# Altium schematic sheet currentU_conditioning.SchDoc
size A4; SheetNumber: 2; SheetTotal: 12; SPICEModelCacheJNOYGZHY: <root> / <DocumentId>JNOYGZHY</DocumentId> / </root>
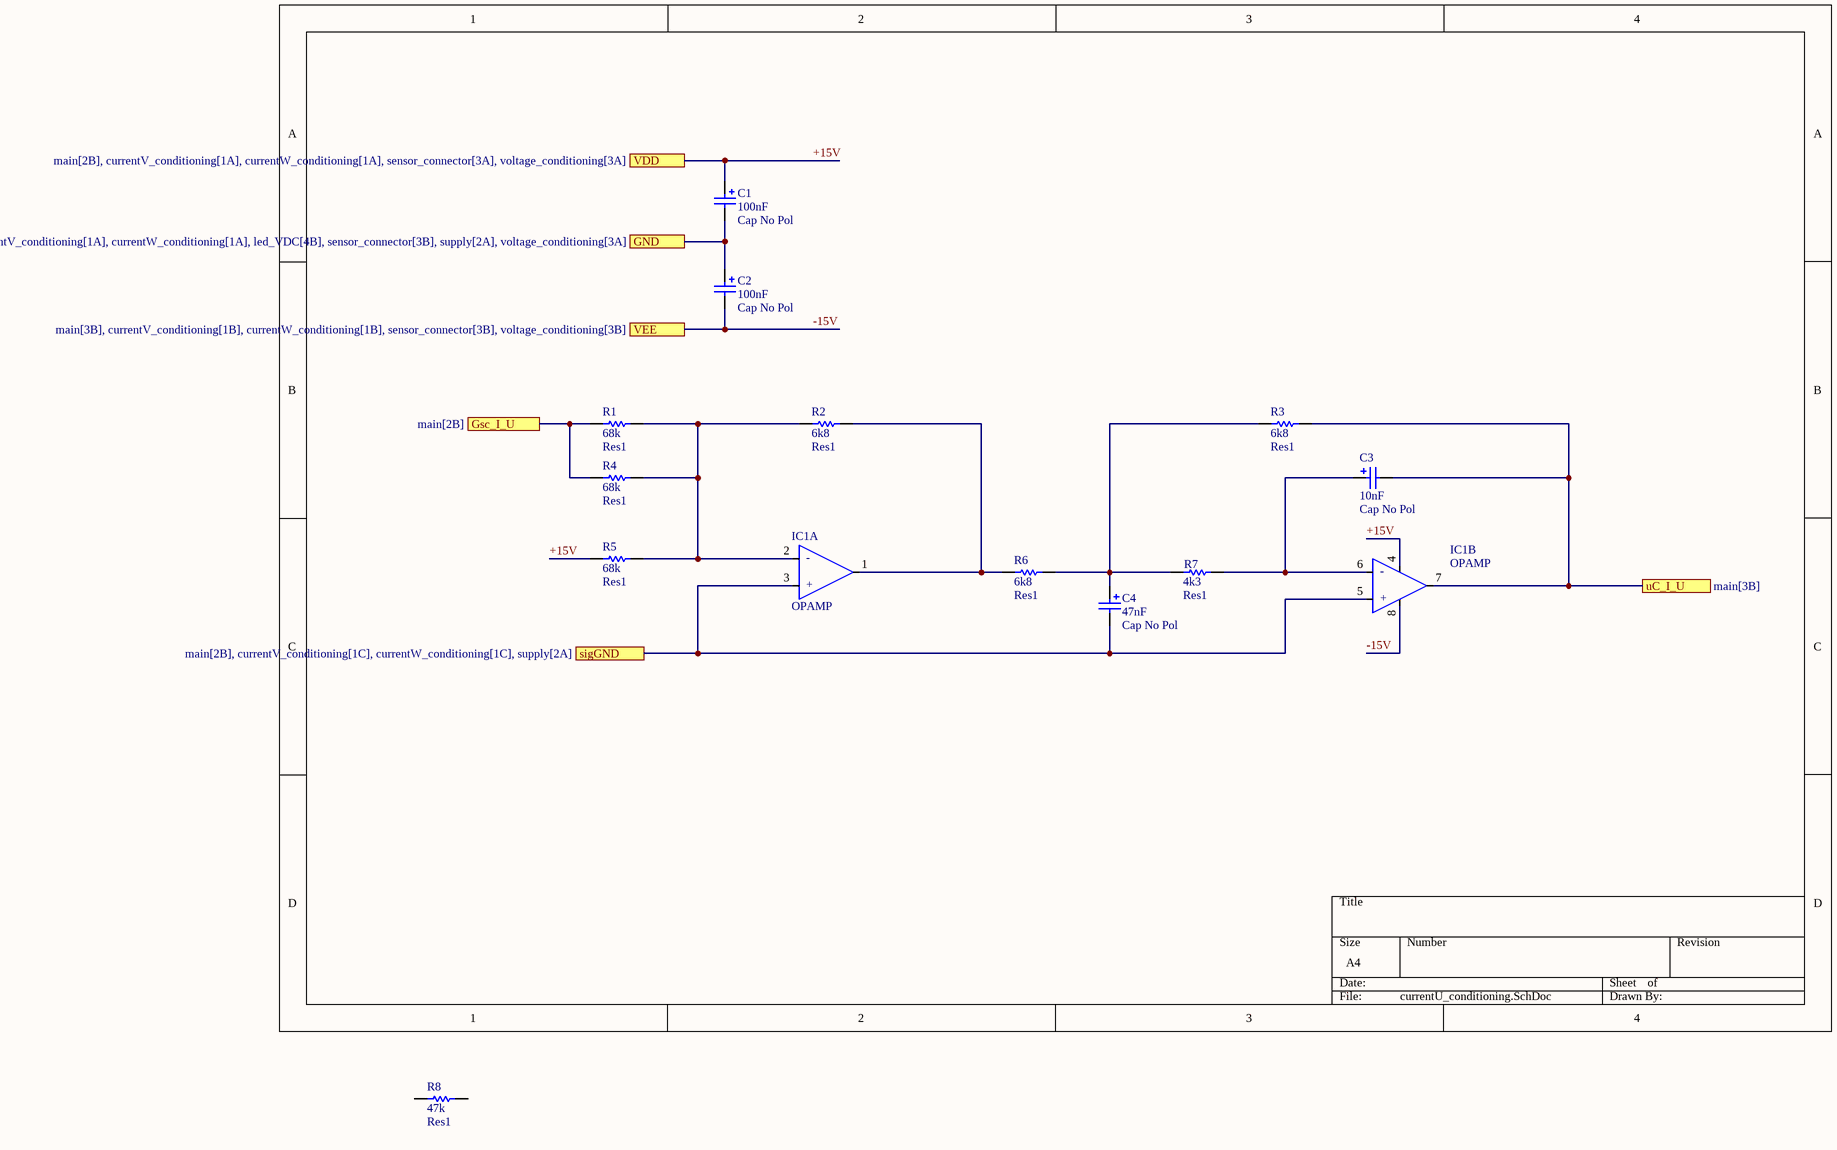
[diagram p0: currentU_conditioning.SchDoc]

## Parts
C1  Cap No Pol  value 100nF  [RAD-0.1]
C2  Cap No Pol  value 100nF  [RAD-0.1]
C3  Cap No Pol  value 10nF  [RAD-0.1]
C4  Cap No Pol  value 47nF  [RAD-0.1]
IC1  OPAMP  [DIP-8]  (parts A,B of 2)
R1  Res1  value 68k  [AXIAL-0.3]
R2  Res1  value 6k8  [AXIAL-0.3]
R3  Res1  value 6k8  [AXIAL-0.3]
R4  Res1  value 68k  [AXIAL-0.3]
R5  Res1  value 68k  [AXIAL-0.3]
R6  Res1  value 6k8  [AXIAL-0.3]
R7  Res1  value 4k3  [AXIAL-0.3]
R8  Res1  value 47k  [AXIAL-0.3]

## Ports
GND (see main[3B], buffer[2A], control_connector[2D], currentV_conditioning[1A], currentW_conditioning[1A], led_VDC[4B], sensor_connector[3B], supply[2A], voltage_conditioning[3A]), Gsc_I_U (see main[2B]), sigGND (see main[2B], currentV_conditioning[1C], currentW_conditioning[1C], supply[2A]), uC_I_U (see main[3B]), VDD (see main[2B], currentV_conditioning[1A], currentW_conditioning[1A], sensor_connector[3A], voltage_conditioning[3A]), VEE (see main[3B], currentV_conditioning[1B], currentW_conditioning[1B], sensor_connector[3B], voltage_conditioning[3B])

## Nets
+15V: C1.1 IC1.4(-V) R5.1 ; port VDD
-15V: C2.2 IC1.8(V+) ; port VEE
GND: C1.2 C2.1 ; port GND
Gsc_I_U: R1.1 R4.1 ; port Gsc_I_U
sigGND: C4.2 IC1.3(IN_A_+) IC1.5(IN_B_+) ; port sigGND
uC_I_U: C3.2 IC1.7(OUT_B) R3.2 ; port uC_I_U
NetC3_1: C3.1 IC1.6(IN_B_-) R7.2
NetC4_1: C4.1 R3.1 R6.2 R7.1
NetIC1_1: IC1.1(OUT_A) R2.2 R6.1
NetIC1_2: IC1.2(IN_A_-) R1.2 R2.1 R4.2 R5.2

Not connected (* = marked no-connect by the designer): R8 1 2

## Notes on the sheet
- (in symbol ADTL082, part A) -; +
- (in symbol ADTL082, part B) -; +

## Library data of the parts
C1-C4 = Cap No Pol: Polarized Capacitor (Radial); Published: 8-Jun-2000; LatestRevisionDate: 17-Jul-2002; LatestRevisionNote: Re-released for DXP Platform.; PackageReference: RB7.6-15; Publisher: Altium Limited; PackageDescription: Polarized Capacitor (Radial); 2 Leads
IC1 = ADTL082
R1-R8 = Res1: Resistor; Published: 8-Jun-2000; LatestRevisionDate: 17-Jul-2002; LatestRevisionNote: Re-released for DXP Platform.; PackageReference: AXIAL-0.3; Publisher: Altium Limited; PackageDescription: Axial Device, Thru-Hole; 2 Leads; 0.3 in Pin Spacing